# Altium project uz_per_wolfspeed_25kw_FM3.PrjPcb (part 2 of 2)

## Sheet Power.SchDoc
size A4; Organization: UltraZohm; DocumentNumber: 8; SheetNumber: 8; SheetTotal: 11; Website: www.ultrazohm.com
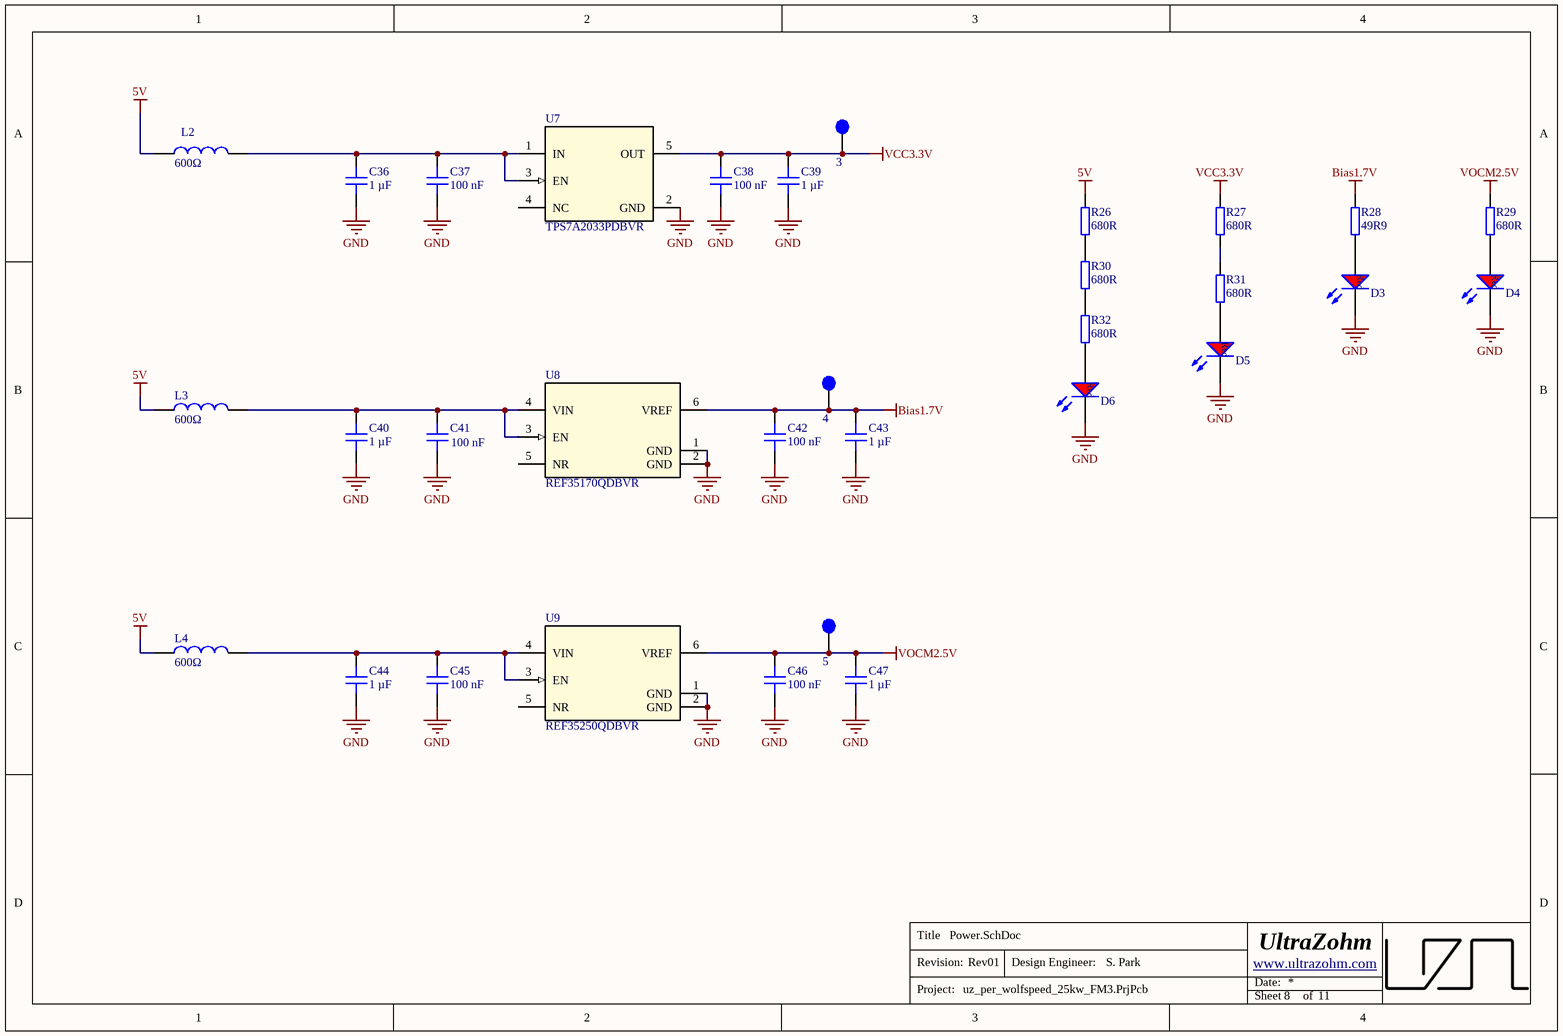
[diagram p6: Power.SchDoc]

### Parts
3  Testpoint 1mm  [TP_1mm]  (value not drawn)  (no BOM)
4  Testpoint 1mm  [TP_1mm]  (value not drawn)  (no BOM)
5  Testpoint 1mm  [TP_1mm]  (value not drawn)  (no BOM)
C36  1 µF  [C_0603]
C37  100 nF  [C_0603]
C38  100 nF  [C_0603]
C39  1 µF  [C_0603]
C40  1 µF  [C_0603]
C41  100 nF  [C_0603]
C42  100 nF  [C_0603]
C43  1 µF  [C_0603]
C44  1 µF  [C_0603]
C45  100 nF  [C_0603]
C46  100 nF  [C_0603]
C47  1 µF  [C_0603]
D3  150060RS75000  [WL-SMCW_0603]  (value not drawn)
D4  150060RS75000  [WL-SMCW_0603]  (value not drawn)
D5  150060RS75000  [WL-SMCW_0603]  (value not drawn)
D6  150060RS75000  [WL-SMCW_0603]  (value not drawn)
L2  600Ω  [WE-CBF_0805_High Current]
L3  600Ω  [WE-CBF_0805_High Current]
L4  600Ω  [WE-CBF_0805_High Current]
R26  680R  [R_0603_N]
R27  680R  [R_0603_N]
R28  49R9  [RES 0603_1608]
R29  680R  [R_0603_N]
R30  680R  [R_0603_N]
R31  680R  [R_0603_N]
R32  680R  [R_0603_N]
U7  TPS7A2033PDBVR  [DBV0005A-IPC_A]
U8  REF35170QDBVR  [DBV0006A-IPC_A]
U9  REF35250QDBVR  [DBV0006A-IPC_A]

### Nets
5V: L2.1 L3.1 L4.1 R26.2
Bias1.7V: 4.1 C42.1 C43.1 R28.1 U8.6(VREF)
GND: C36.2 C37.2 C38.2 C39.2 C40.2 C41.2 C42.2 C43.2 C44.2 C45.2 C46.2 C47.2 D3.1(K) D4.1(K) D5.1(K) D6.1(K) U7.2(GND) U8.1(GND) U8.2(GND) U9.1(GND) U9.2(GND)
VCC3.3V: 3.1 C38.1 C39.1 R27.2 U7.5(OUT)
VOCM2.5V: 5.1 C46.1 C47.1 R29.2 U9.6(VREF)
NetC36_1: C36.1 C37.1 L2.2 U7.1(IN) U7.3(EN)
NetC40_1: C40.1 C41.1 L3.2 U8.3(EN) U8.4(VIN)
NetC44_1: C44.1 C45.1 L4.2 U9.3(EN) U9.4(VIN)
NetD3_2: D3.2(A) R28.2
NetD4_2: D4.2(A) R29.1
NetD5_2: D5.2(A) R31.1
NetD6_2: D6.2(A) R32.1
NetR26_1: R26.1 R30.2
NetR27_1: R27.1 R31.2
NetR30_1: R30.1 R32.2

Not connected (* = marked no-connect by the designer): U7 4(NC); U8 5(NR); U9 5(NR)

### Notes on the sheet
- Title
- Revision:
- Design Engineer:
- Date:
- Project:
- Sheet
- of

### Library data of the parts
3-5 = TP_1mm: Created: 2018_06_25_AGeiger; Value: Testpoint 1mm
C36 C39 C40 C43 C44 C47 = C0603C105K3RAC7411: Capacitor 0603, 25 VDC, 1 µF, X7R; Manufacturer: KEMET; Tolerance: 10 %; Voltage Rating: 25 VDC; Created from: MGremer; Manufacturer Part Number: C0603C105K3RAC7411; PartID: 4; Created On: 20/12/2020 13:54:13; ComponentLink1Description: Datasheet; ComponentLink1URL: https://www.mouser.de/datasheet/2/212/KEM_C1002_X7R_SMD-1102033.pdf; Component Type: Capacitor 0603; Device Package: 0603; Last Updated: 20/12/2020 16:43:05; Mounting Type: SMD; Operating Temperature: -55 - 125°C; Series: SMD Comm X7R; Supplier 1: Mouser; Supplier Part Number 1: 80-C0603C105K3RLR; Type: Capacitor; Value: 1 µF; Live Cycle Status: 1; Stock number: Labor SMD Container; LCSC Part Number: C29936
C37 C38 C41 C42 C45 C46 = C0603C104K5RAC3121: Capacitor 0603, 50 VDC, 100nF, X7R; Manufacturer: KEMET; Tolerance: 10 %; Voltage Rating: 50 VDC; Created from: DHufnagel; Manufacturer Part Number: C0603C104K5RAC3121; PartID: 99; Created On: 11/08/2022 14:33:29; ComponentLink1Description: Datasheet; ComponentLink1URL: https://www.mouser.de/datasheet/2/212/KEM_C1023_X7R_AUTO_SMD-1093309.pdf; Component Type: Capacitor 0603; Device Package: 0603; Last Updated: 19/08/2022 08:26:58; Mounting Type: SMD; Operating Temperature: -55 - 125°C; Series: X7R; Supplier 1: Mouser; Supplier Part Number 1: 80-C603C104K5RAC3121; Supplier 2: LCSC; Supplier Part Number 2: C14663; Type: Capacitor; Value: 100 nF; Live Cycle Status: 1; LCSC Part Number: C14663; Stock number: not stored
D3-D6 = LED_Red_0603: WL-SMCW SMD Mono-color Chip LED Waterclear, size 0603, Red, 2 V, 140°; Forward Voltage: 2 V; Luminous Intensity: 250 mcd; Peak Wavelength: 630 nm; Dominant Wavelength: 625 nm; MF: Wuerth Elektronik; Published Date: Sep. 2017; ComponentLink1Description: Manufacturer; ComponentLink1URL: http://www.we-online.de; ComponentLink2Description: Datasheet; ComponentLink2URL: http://katalog.we-online.com/led/datasheet/150060RS75000.pdf; MPN: 150060RS75000; Size: 0603; Viewing Angle: 140°; Emitting Color: Red; Value: 150060RS75000; Package: 0603; Created: 2018_09_06_AGeiger; Supplier 1: Farnell; Supplier Part Number 1: 2322071; Supplier 2: Mouser; Supplier Part Number 2: 710-150060RS75000; Supplier 3: Digi-Key; Supplier Part Number 3: 732-4978-1-ND; LCSC Part Number: C2286
L2-L4 = WE-CBF, 742792040: WE-CBF SMD EMI Suppression Ferrite Bead, 0805, 600Ω; MF: Wurth Elektronik; Type: High Current; PublishedDate: Aug 2016; ComponentLink1Description: Manufacturer; ComponentLink1URL: http://www.we-online.de; ComponentLink2Description: Datasheet; ComponentLink2URL: http://katalog.we-online.de/pbs/datasheet/742792040.pdf; MPN: 742792040; Value: 600Ω; Package: 0805; Supplier 1: Farnell; Supplier 2: Mouser; Supplier 3: Digi-Key; Supplier Part Number 1: 2761567; Supplier Part Number 2: 710-742792040; Supplier Part Number 3: 732-1620-1-ND; LCSC Part Number: C98308
R26 R27 R29-R32 = R_0603: SMD Resistor 0603; MPN: CR0603-FX-3901ELF; Tolerance: 1%; Voltage: 75V; Power: 100 mW; MF: Bourns; Package: 0603; Value: 680R; Created: 2018_09_06_AGeiger; Supplier 1: Mouser; Supplier Part Number 1: 652-CR0603-FX3901ELF; LCSC Part Number: C23228
R28 = RK73H1JTTD49R9F: SMD resistor 1%; Manufacturer: KOA Speer; Created from: DHufnagel; Manufacturer Part Number: RK73H1JTTD49R9F; PartID: 214; Created On: 14.12.2020 16:17:14; ComponentLink1Description: Datasheet; ComponentLink1URL: https://www.mouser.de/datasheet/2/219/RK73H-1825326.pdf; Component Type: SMD resistor; Device Package: 0603; Last Updated: 27.05.2022 13:46:35; Mounting Type: SMD; Supplier 1: Mouser; Supplier Part Number 1: 660-RK73H1JTTD49R9F; Supplier 2: LCSC; Supplier Part Number 2: C160046; Type: Resistor; Tolerance: 1%; Value: 49R9; Live Cycle Status: 1; Stock number: not stored; LCSC Part Number: C160046
U7 = TPS7A2033PDBVR: No Description Available; Mfr_Name: Texas Instruments; TYPE: TYPE; RefDes: RefDes; LCSC Part Number: C2862740
U8 = REF35170QDBVR: No Description Available; Mfr_Name: Texas Instruments; TYPE: TYPE; RefDes: RefDes; LCSC Part Number: C20345634
U9 = REF35250QDBVR: No Description Available; Mfr_Name: Texas Instruments; TYPE: TYPE; RefDes: RefDes; LCSC Part Number: C6265005

## Sheet DCVoltageConditioning.SchDoc
size A4; Organization: UltraZohm; DocumentNumber: 4; SheetNumber: 4; SheetTotal: 11; Website: www.ultrazohm.com
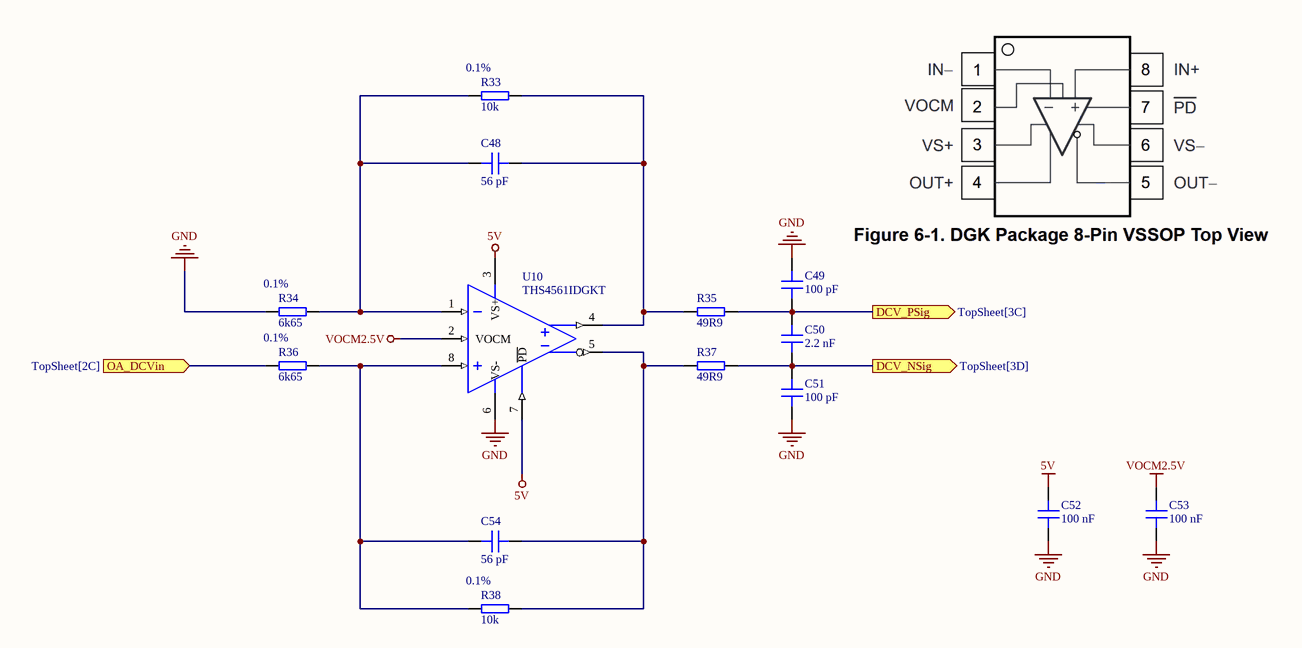
[diagram p7: DCVoltageConditioning.SchDoc]

### Parts
C48  56 pF  [C_0603]
C49  100 pF  [C_0603_TE]
C50  2.2 nF  [C_0603]
C51  100 pF  [C_0603_TE]
C52  100 nF  [C_0603]
C53  100 nF  [C_0603]
C54  56 pF  [C_0603]
R33  10k  Tolerance: 0.1%  [RES 0603_1608]
R34  6k65  Tolerance: 0.1%  [RES 0603_1608]
R35  49R9  [RES 0603_1608]
R36  6k65  Tolerance: 0.1%  [RES 0603_1608]
R37  49R9  [RES 0603_1608]
R38  10k  Tolerance: 0.1%  [RES 0603_1608]
U10  THS4561IDGKT  [SOP65P490X110-8N]

### Ports
DCV_NSig (out, see TopSheet[3D]), DCV_PSig (out, see TopSheet[3C]), OA_DCVin (in, see TopSheet[2C])

### Nets
5V: C52.1 U10.3(VS+) U10.7(~{PD})
GND: C49.1 C51.2 C52.2 C53.2 R34.1 U10.6(VS-)
VOCM2.5V: C53.1 U10.2(VOCM)
AnSig4_N: C50.2 C51.1 R37.2 ; port DCV_NSig
AnSig4_P: C49.2 C50.1 R35.2 ; port DCV_PSig
OpAinSig4: R36.1 ; port OA_DCVin
NetC48_1: C48.1 R33.1 R34.2 U10.1(VIN-)
NetC48_2: C48.2 R33.2 R35.1 U10.4(VOUT+)
NetC54_1: C54.1 R36.2 R38.1 U10.8(VIN+)
NetC54_2: C54.2 R37.1 R38.2 U10.5(VOUT-)

### Notes on the sheet
- Title
- Revision:
- Design Engineer:
- Date:
- Project:
- Sheet
- of

### Library data of the parts
C48 C54 = CL10C560JB8NNNC: Capacitor 0603, 50 VDC, 56 pF, C0G; Manufacturer: Samsung Electro-Mechanics; Tolerance: 5 %; Voltage Rating: 50 VDC; Created from: DHufnagel; Manufacturer Part Number: CL10C560JB8NNNC; PartID: 92; Created On: 20/12/2020 13:54:13; ComponentLink1Description: Datasheet; ComponentLink1URL: https://www.mouser.de/datasheet/2/585/MLCC-1837944.pdf; Component Type: Capacitor 0603; Device Package: 0603; Last Updated: 20/12/2020 16:24:16; Mounting Type: SMD; Operating Temperature: -55 - 125°C; Series: CL; Supplier 1: Mouser; Supplier Part Number 1: 187-CL10C560JB8NNNC; Supplier 2: LCSC; Supplier Part Number 2: C39148; Type: Capacitor; Value: 56 pF; Live Cycle Status: 1; LCSC Part Number: C39148; Stock number: not stored
C49 C51 = CL10C101JB8NNNC: 50V 100pF C0G ±5% 0603 Multilayer Ceramic Capacitors MLCC - SMD/SMT ROHS; Manufacturer: Samsung Electro-Mechanics; Voltage Rating: 50 VDC; Created from: AGeiger; Manufacturer Part Number: CL10C101JB8NNNC; PartID: 106; Created On: 03/09/2022 10:55:28; ComponentLink1Description: Datasheet; ComponentLink1URL: https://datasheet.lcsc.com/lcsc/1811151136_Samsung-Electro-Mechanics-CL10C101JB8NNNC_C14858.pdf; Component Type: Capacitor 0603; Device Package: 0603; Last Updated: 08/08/2024 13:37:35; Mounting Type: SMD; Operating Temperature: -55 - 125°C; Series: C0G; Supplier 1: LCSC; Supplier Part Number 1: C14858; Supplier 2: Mouser; Supplier Part Number 2: 187-CL10C101JB8NNNC; Type: Capacitor; Tolerance: 5 %; Value: 100 pF; Live Cycle Status: 1; LCSC Part Number: C14858
C50 = 06035C222JAT2A: Capacitor 0603, 50 VDC, 2.2 nF, X7R; Manufacturer: AVX; Tolerance: 5 %; Voltage Rating: 50 VDC; Created from: MGremer; Manufacturer Part Number: 06035C222JAT2A; PartID: 77; Created On: 20/12/2020 13:54:13; ComponentLink1Description: Datasheet; ComponentLink1URL: https://www.mouser.de/datasheet/2/40/X7RDielectric-777024.pdf; Component Type: Capacitor 0603; Device Package: 0603; Last Updated: 15/02/2023 17:14:22; Mounting Type: SMD; Operating Temperature: -55 - 125°C; Series: MLCC X7R; Supplier 1: Mouser; Supplier Part Number 1: 581-06035C222J; Supplier 2: LCSC; Supplier Part Number 2: C86023; Type: Capacitor; Value: 2.2 nF; Live Cycle Status: 1; Stock number: not stored; LCSC Part Number: C93190
C52 C53 = C0603C104K5RAC3121: as C37 on sheet Power; Manufacturer Part Number: C0603C104K5RAC3121; PartID: 99; Created On: 11/08/2022 14:33:29; ComponentLink1Description: Datasheet; ComponentLink1URL: https://www.mouser.de/datasheet/2/212/KEM_C1023_X7R_AUTO_SMD-1093309.pdf; Component Type: Capacitor 0603; Device Package: 0603; Last Updated: 19/08/2022 08:26:58; Mounting Type: SMD; Operating Temperature: -55 - 125°C; Series: X7R; Supplier 1: Mouser; Supplier Part Number 1: 80-C603C104K5RAC3121; Supplier 2: LCSC; Supplier Part Number 2: C14663; Type: Capacitor; Value: 100 nF; Live Cycle Status: 1; LCSC Part Number: C14663; Stock number: not stored
R33 R38 = ERA-3ARB103V: SMD resistor 0.1%, 10ppm; Manufacturer: Panasonic; Created from: DHufnagel; Manufacturer Part Number: ERA-3ARB103V; PartID: 217; Created On: 14/12/2020 16:17:14; ComponentLink1Description: Datasheet; ComponentLink1URL: https://www.mouser.de/datasheet/2/315/AOA0000C307-1149632.pdf; Component Type: SMD resistor; Device Package: 0603; Last Updated: 25/07/2022 10:07:28; Mounting Type: SMD; Supplier 1: Mouser; Supplier Part Number 1: 667-ERA-3ARB103V; Type: Resistor; Value: 10k; Live Cycle Status: 1; Stock number: not stored; LCSC Part Number: C860067
R34 R36 = RT0603BRD076K65L: 100mW Thin Film Resistor ±25ppm/℃ ±0.1% 6.65kΩ 0603 Chip Resistor - Surface Mount ROHS; Manufacturer: YAGEO; Created from: SPark; Manufacturer Part Number: RT0603BRD076K65L; PartID: 361; Created On: 30/01/2025 15:18:29; ComponentLink1Description: Datasheet; ComponentLink1URL: https://wmsc.lcsc.com/wmsc/upload/file/pdf/v2/lcsc/2210190000_YAGEO-RT0603BRD076K65L_C861536.pdf; Component Type: SMD resistor; Device Package: 0603; Last Updated: 30/01/2025 15:27:22; Mounting Type: SMD; Supplier 1: LCSC/JLCPCB; Supplier Part Number 1: C861536; Type: Resistor; Value: 6k65; Live Cycle Status: 1; LCSC Part Number: C861536
R35 R37 = RK73H1JTTD49R9F: as R28 on sheet Power; Manufacturer Part Number: RK73H1JTTD49R9F; PartID: 214; Created On: 14/12/2020 16:17:14; ComponentLink1Description: Datasheet; ComponentLink1URL: https://www.mouser.de/datasheet/2/219/RK73H-1825326.pdf; Component Type: SMD resistor; Device Package: 0603; Last Updated: 27/05/2022 13:46:35; Mounting Type: SMD; Supplier 1: Mouser; Supplier Part Number 1: 660-RK73H1JTTD49R9F; Supplier 2: LCSC; Supplier Part Number 2: C160046; Type: Resistor; Tolerance: 1%; Value: 49R9; Live Cycle Status: 1; Stock number: not stored; LCSC Part Number: C160046
U10 = THS4561IDGKT: Fully Differential Amplifier, Low-Power, High Supply Range, 60-MHz; Manufacturer: Texas Instruments; Channels: 1; GBP: 68 MHz; CMRR: 110 dB; Value: Rail-to-Rail; Created from: DHufnagel; Manufacturer Part Number: THS4561IDGKT; PartID: 13; Created On: 08/07/2022 14:29:07; ComponentLink1Description: Datasheet; ComponentLink1URL: https://www.ti.com/general/docs/suppproductinfo.tsp?distId=26&gotoUrl=https://www.ti.com/lit/gpn/ths4561; Component Type: Differential Amplifier; Device Package: VSSOP-8; Last Updated: 30/09/2024 15:54:43; Mounting Type: SMD; Operating Temperature: -40 to +125 °C; Series: THS4561; Supplier 1: Mouser; Supplier Part Number 1: 595-THS4561IDGKT; Supplier 2: Digi-Key; Supplier Part Number 2: 296-THS4561IDGKTCT-ND; Type: Differential Amplifiers; Live Cycle Status: 1; Stock number: not stored; LCSC Part Number: C2860980

## Nets that join several sheets
5V: Connector_Inverter (9 pins), OA_CC1 (C10A.1 U1A.3 U1A.7), OA_CC2 (C10B.1 U1B.3 U1B.7), OA_CC3 (C10C.1 U1C.3 U1C.7), Power (L2.1 L3.1 L4.1 R26.2), DCVoltageConditioning (C52.1 U10.3 U10.7)
Bias1.7V: OA_CC1 (R3A.1), OA_CC2 (R3B.1), OA_CC3 (R3C.1), Power (5 pins)
GND: TopSheet (R1.1), Connector_Inverter (23 pins), OA_CC1 (5 pins), OA_CC2 (5 pins), OA_CC3 (5 pins), T1 (C15A.2 C16A.2 R13A.2 U3A.2), T2 (C15B.2 C16B.2 R13B.2 U3B.2), OvercurrentDetection (23 pins), R1 (5 pins), R2 (5 pins), R3 (5 pins), R4 (5 pins), R5 (5 pins), R6 (5 pins), R7 (5 pins), Power (21 pins), DCVoltageConditioning (6 pins)
VCC3.3V: Connector_Inverter (X2.05 X2.06), T1 (6 pins), T2 (6 pins), OvercurrentDetection (12 pins), R1 (5 pins), R2 (5 pins), R3 (5 pins), R4 (5 pins), R5 (5 pins), R6 (5 pins), R7 (5 pins), Power (5 pins)
VOCM2.5V: OA_CC1 (C11A.1 U1A.2), OA_CC2 (C11B.1 U1B.2), OA_CC3 (C11C.1 U1C.2), Power (5 pins), DCVoltageConditioning (C53.1 U10.2)
AnSig4_N: TopSheet (X1.A2), DCVoltageConditioning (C50.2 C51.1 R37.2)
AnSig4_P: TopSheet (X1.A1), DCVoltageConditioning (C49.2 C50.1 R35.2)
AnSig_N: TopSheet (X1.A5), OA_CC2 (C8B.2 C9B.1 R6B.2)
AnSig_N: TopSheet (X1.A6), OA_CC3 (C8C.2 C9C.1 R6C.2)
AnSig_N: TopSheet (X1.A8), OA_CC1 (C8A.2 C9A.1 R6A.2)
AnSig_P: TopSheet (X1.A3), OA_CC3 (C7C.2 C8C.1 R4C.2)
AnSig_P: TopSheet (X1.A4), OA_CC2 (C7B.2 C8B.1 R4B.2)
AnSig_P: TopSheet (X1.A7), OA_CC1 (C7A.2 C8A.1 R4A.2)
OpAinSig1: Connector_Inverter (J1.33), OA_CC1 (R5A.1), OvercurrentDetection (X3.01)
OpAinSig2: Connector_Inverter (J1.37), OA_CC2 (R5B.1), OvercurrentDetection (X3.03)
OpAinSig3: Connector_Inverter (J1.39), OA_CC3 (R5C.1), OvercurrentDetection (X3.05)
OpAinSig4: Connector_Inverter (J1.27), DCVoltageConditioning (R36.1)
ReceiverSig1: Connector_Inverter (J1.49), R1 (U2A.6)
ReceiverSig2: Connector_Inverter (J1.51), R2 (U2B.6)
ReceiverSig3: Connector_Inverter (J1.53), R3 (U2C.6)
ReceiverSig4: Connector_Inverter (J1.55), R4 (U2D.6)
ReceiverSig5: Connector_Inverter (J1.50), R5 (U2E.6)
ReceiverSig6: Connector_Inverter (J1.52), R6 (U2F.6)

## Assembly variants
default: all parts fitted
jlc: not fitted J2A J2B J2C J2D J2E J2F J2G J3A J3B